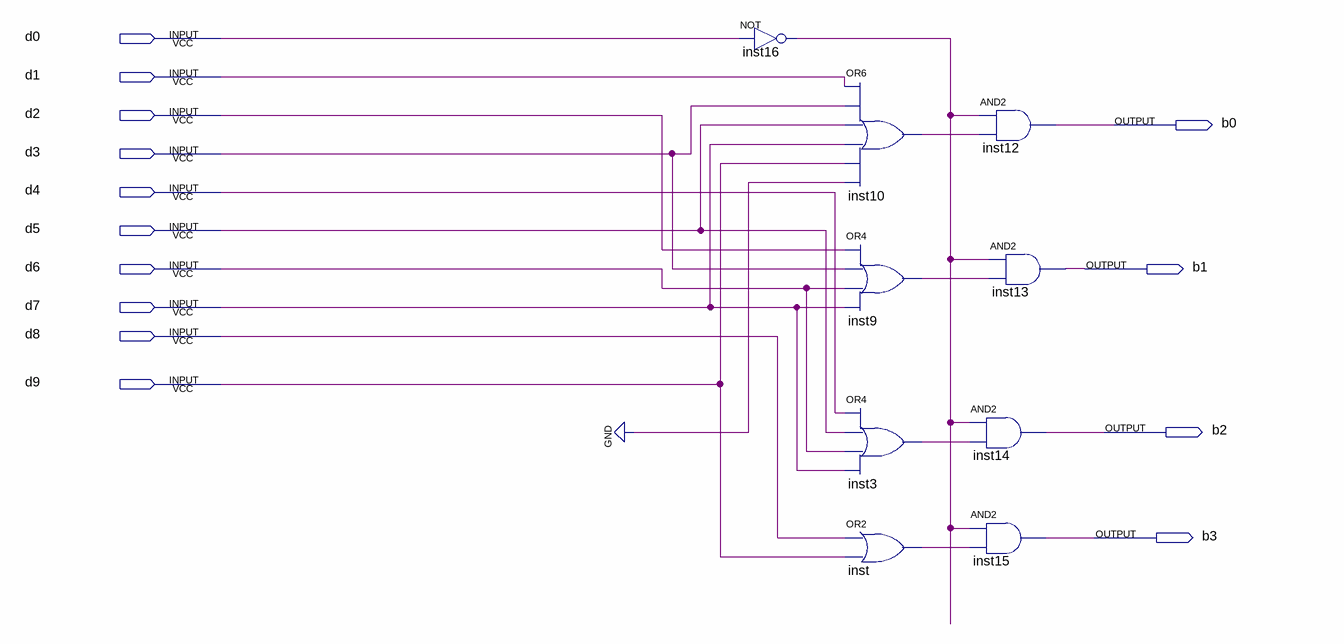
[diagram p0: schematic sheet]
// Quartus schematic decimal_to_binary.bdf as structural Verilog: 9 symbols, 14 pins
module decimal_to_binary (
  input  d0,
  input  d1,
  input  d2,
  input  d3,
  input  d4,
  input  d5,
  input  d6,
  input  d7,
  input  d8,
  input  d9,
  output b0,
  output b1,
  output b2,
  output b3
);

  wire inst3_out, inst9_out, inst10_out, inst16_out, inst_out;

  not inst16 (inst16_out, d0);
  or inst10 (inst10_out, d1, d3, d5, d7, d9, 1'b0);
  or inst9 (inst9_out, d2, d3, d6, d7);
  or inst3 (inst3_out, d4, d5, d6, d7);
  or inst (inst_out, d8, d9);
  and inst12 (b0, inst16_out, inst10_out);
  and inst13 (b1, inst16_out, inst9_out);
  and inst14 (b2, inst16_out, inst3_out);
  and inst15 (b3, inst16_out, inst_out);
endmodule
